# Altium schematic sheet Sheet1_Overview.SchDoc: =ProjectName
size A4; DocumentNumber: 1; SheetNumber: 1; SheetTotal: 5
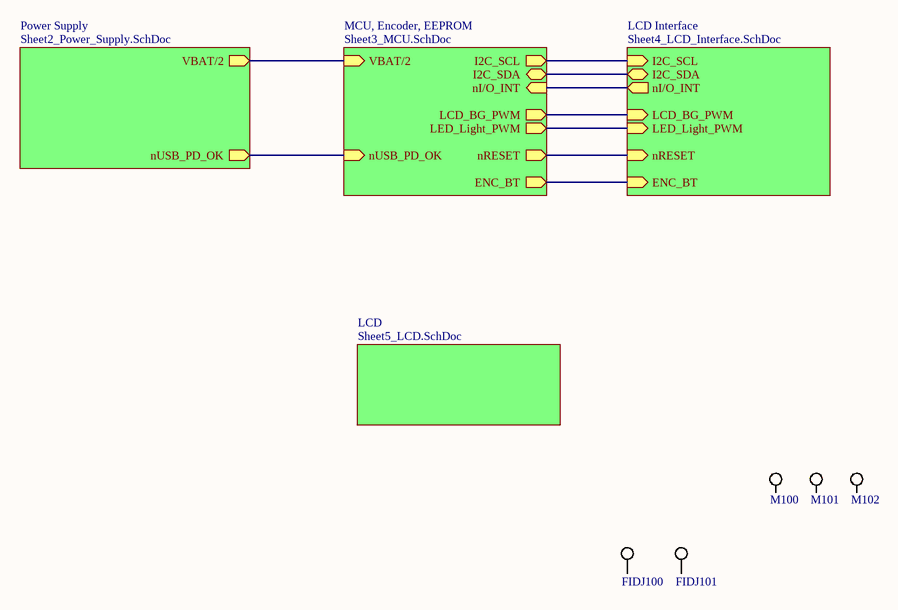
[diagram p0: Sheet1_Overview.SchDoc]

## Parts
FIDJ100  Fiducial  [FIDJ_1mm]  (value not drawn)  (net tie, no BOM)
FIDJ101  Fiducial  [FIDJ_1mm]  (value not drawn)  (net tie, no BOM)
M100  M3x8  [SCREW_M3x8_nP_FH]  (value not drawn)  (net tie, no BOM)
M101  M3x8  [SCREW_M3x8_nP_FH]  (value not drawn)  (net tie, no BOM)
M102  M3x8  [SCREW_M3x8_nP_FH]  (value not drawn)  (net tie, no BOM)

## Sub-sheets
LCD = Sheet5_LCD.SchDoc: no entries
LCD Interface = Sheet4_LCD_Interface.SchDoc: nI/O_INT (out), I2C_SCL (in), LCD_BG_PWM (in), nRESET (in), LED_Light_PWM (in), I2C_SDA (bidir), ENC_BT (in)
MCU, Encoder, EEPROM = Sheet3_MCU.SchDoc: nI/O_INT (in), I2C_SCL (out), LCD_BG_PWM (out), LED_Light_PWM (out), I2C_SDA (bidir), VBAT/2 (in), nUSB_PD_OK (in), nRESET (out), ENC_BT (out)
Power Supply = Sheet2_Power_Supply.SchDoc: nUSB_PD_OK (out), VBAT/2 (out)

## Nets
(unnamed): sheet Power Supply/nUSB_PD_OK, sheet MCU, Encoder, EEPROM/nUSB_PD_OK
(unnamed): sheet Power Supply/VBAT/2, sheet MCU, Encoder, EEPROM/VBAT/2
(unnamed): sheet MCU, Encoder, EEPROM/nI/O_INT, sheet LCD Interface/nI/O_INT
(unnamed): sheet MCU, Encoder, EEPROM/I2C_SCL, sheet LCD Interface/I2C_SCL
(unnamed): sheet MCU, Encoder, EEPROM/LCD_BG_PWM, sheet LCD Interface/LCD_BG_PWM
(unnamed): sheet MCU, Encoder, EEPROM/LED_Light_PWM, sheet LCD Interface/LED_Light_PWM
(unnamed): sheet MCU, Encoder, EEPROM/I2C_SDA, sheet LCD Interface/I2C_SDA
(unnamed): sheet MCU, Encoder, EEPROM/nRESET, sheet LCD Interface/nRESET
(unnamed): sheet MCU, Encoder, EEPROM/ENC_BT, sheet LCD Interface/ENC_BT

Not connected (* = marked no-connect by the designer): FIDJ100 1; FIDJ101 1

## Notes on the sheet
- Title
- Size:
- Date:
- A4
- Number:
- Time:
- Revision:
- Sheet
- of
- File:

## Library data of the parts
FIDJ100 FIDJ101 = FIDJ_1mm: Fiducal 1mm
M100-M102 = SCREW_M3x8_nP_FH: Skrew M3x8 Not Plated Flathat